# Altium schematic sheet PocketAnalyzer_BLK_R00.SchDoc
size A4; SheetNumber: 1; SheetTotal: 3
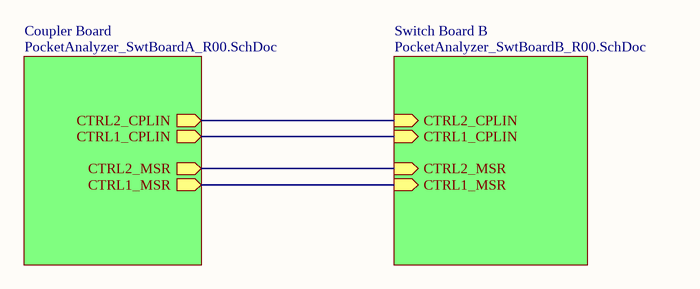
[diagram p0: PocketAnalyzer_BLK_R00.SchDoc]

## Sub-sheets
Coupler Board = PocketAnalyzer_SwtBoardA_R00.SchDoc: CTRL2_CPLIN (out), CTRL1_CPLIN (out), CTRL2_MSR (out), CTRL1_MSR (out)
Switch Board B = PocketAnalyzer_SwtBoardB_R00.SchDoc: CTRL2_CPLIN (in), CTRL1_CPLIN (in), CTRL2_MSR (in), CTRL1_MSR (in)

## Nets
(unnamed): sheet Coupler Board/CTRL2_CPLIN, sheet Switch Board B/CTRL2_CPLIN
(unnamed): sheet Coupler Board/CTRL1_CPLIN, sheet Switch Board B/CTRL1_CPLIN
(unnamed): sheet Coupler Board/CTRL2_MSR, sheet Switch Board B/CTRL2_MSR
(unnamed): sheet Coupler Board/CTRL1_MSR, sheet Switch Board B/CTRL1_MSR